# EAGLE design ChameleonMini-RevG (EAGLE 6.6.0)

## Sheet 1 of 2
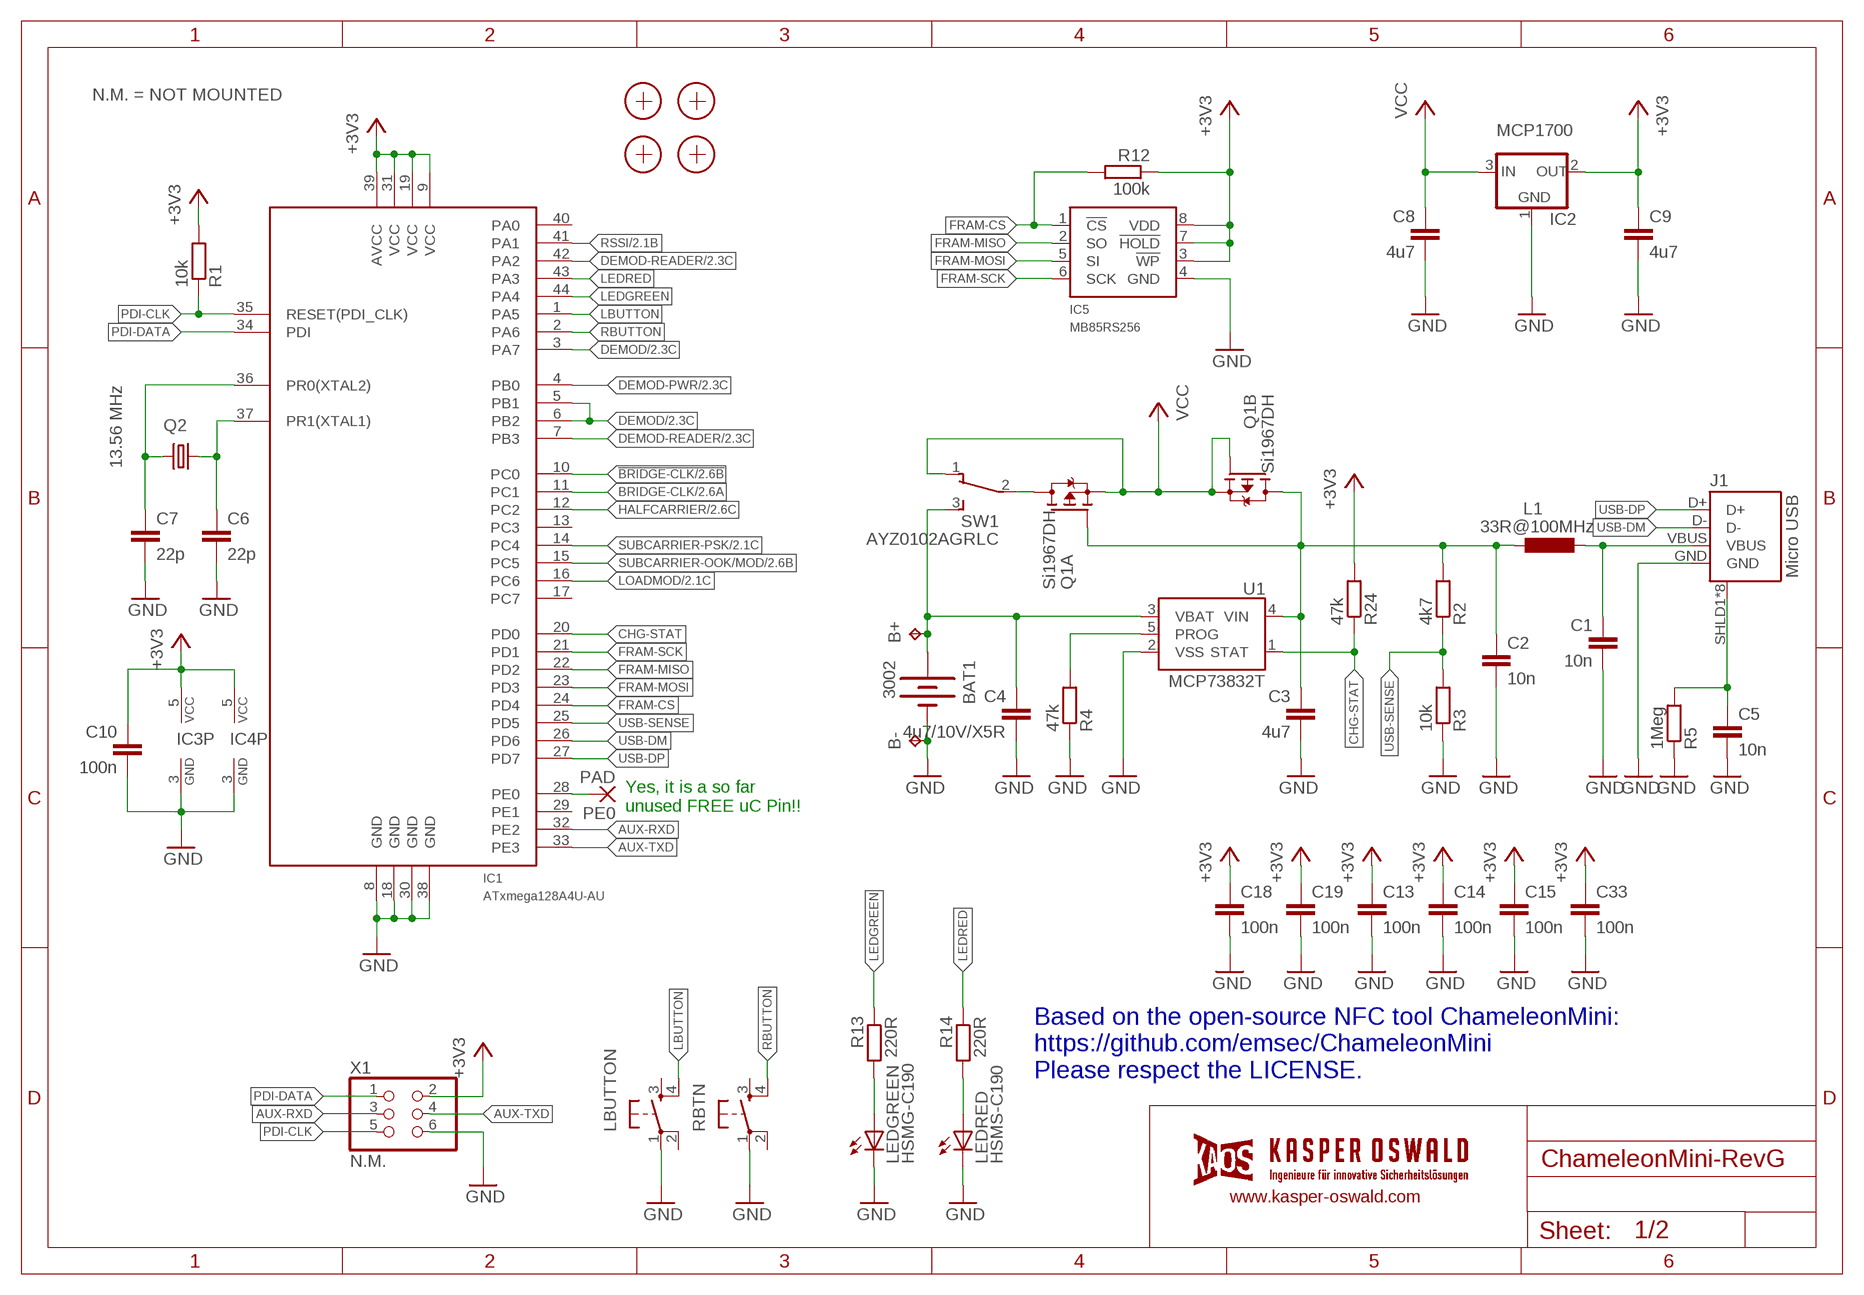
[diagram p0: schematic, sheet 1]

### Parts
B+  TPTP18SQ  [TP18SQ]
B-  TPTP18SQ  [TP18SQ]
BAT1  3002  [BATTCON_20MM]
C1  10n  C-EUC1206K  [C1206K]
C2  10n  C-EUC1206K  [C1206K]
C3  4u7  C-EUC0603K  [C0603K]
C4  4u7/10V/X5R  C-EUC0603K  [C0603K]
C5  10n  C-EUC0603K  [C0603K]
C6  22p  C-EUC0603K  [C0603K]
C7  22p  C-EUC0603K  [C0603K]
C8  4u7  C-EUC0603K  [C0603K]
C9  4u7  C-EUC0603K  [C0603K]
C10  100n  C-EUC0603K  [C0603K]
C13  100n  C-EUC0603K  [C0603K]
C14  100n  C-EUC0603K  [C0603K]
C15  100n  C-EUC0603K  [C0603K]
C18  100n  C-EUC0603K  [C0603K]
C19  100n  C-EUC0603K  [C0603K]
C33  100n  C-EUC0603K  [C0603K]
IC1  ATxmega128A4U-AU  ATXMEGA_A4-A  [TQFP44]
IC2  MCP1700  MCP1702  [SOT23]
IC3  7408  74LVC1G08DCK  [SC70-5]
IC4  7486  74AHC1G86DCK  [SC70-5]
IC5  MB85RS256  MB85RS  [SO-08]
J1  Micro USB  USB-MICROB-2  [USB-MICROB-10118194]
L1  33R@100MHz  L-EUL2012C  [L2012C]
LBUTTON  SWITCH_SPST_4_PINSQUARE  [TACTILE-SWITCH-SMD]
LEDGREEN  HSMG-C190  LED-0603  [CHIPLED-0603]
LEDRED  HSMS-C190  LED-0603  [CHIPLED-0603]
PE0  PAD  WIREPADSMD1,27-254  [SMD1,27-2,54]
Q1  Si1967DH  BSS84AKS  [SOT363]
Q2  13.56 MHz  TXC7B  [5MMX3.2MM]
R1  10k  R-EU_R0603  [R0603]
R2  4k7  R-EU_R0603  [R0603]
R3  10k  R-EU_R0603  [R0603]
R4  47k  R-EU_R0603  [R0603]
R5  1Meg  R-EU_R0603  [R0603]
R12  100k  R-EU_R0603  [R0603]
R13  220R  R-EU_R0603  [R0603]
R14  220R  R-EU_R0603  [R0603]
R24  47k  R-EU_R0603  [R0603]
RBTN  SWITCH_SPST_4_PINSQUARE  [TACTILE-SWITCH-SMD]
SW1  AYZ0102AGRLC  [AYZ0102AGRLC]
U1  MCP73832T  MCP73831  [SOT23-5]
X1  N.M.  PINHD-2X3-2.54-EDGE  [PINHD-2X3-2.54-EDGE]
X2  PASSER-07  [PASSER_07MM]
X4  PASSER-07  [PASSER_07MM]
X5  PASSER-07  [PASSER_07MM]
X6  PASSER-07  [PASSER_07MM]

### Nets
!BRIDGE-CLK: IC1.10(PC0) ; also sheet 2
+3V3: C9.1 C10.1 C13.1 C14.1 C15.1 C18.1 C19.1 C33.1 IC1.9(VCC) IC1.19(VCC) IC1.31(VCC) IC1.39(AVCC) IC2.2(OUT) IC3.5(VCC) IC4.5(VCC) IC5.3(!WP) IC5.7(!HOLD) IC5.8(VDD) R1.2 R12.1 R24.2 X1.2 ; also sheet 2
AUX-RXD: IC1.32(PE2) X1.3
AUX-TXD: IC1.33(PE3) X1.4
BRIDGE-CLK: IC1.11(PC1) ; also sheet 2
CHG-STAT: IC1.20(PD0) R24.1 U1.1(STAT)
DEMOD: IC1.3(PA7) IC1.5(PB1) IC1.6(PB2) ; also sheet 2
DEMOD-PWR: IC1.4(PB0) ; also sheet 2
DEMOD-READER: IC1.7(PB3) IC1.42(PA2) ; also sheet 2
FRAM-CS: IC1.24(PD4) IC5.1(!CS) R12.2
FRAM-MISO: IC1.22(PD2) IC5.2(SO)
FRAM-MOSI: IC1.23(PD3) IC5.5(SI)
FRAM-SCK: IC1.21(PD1) IC5.6(SCK)
GND: B-.TP BAT1.- C1.2 C2.2 C3.2 C4.2 C5.2 C6.2 C7.2 C8.2 C9.2 C10.2 C13.2 C14.2 C15.2 C18.2 C19.2 C33.2 IC1.8(GND) IC1.18(GND) IC1.30(GND) IC1.38(GND) IC2.1(GND) IC3.3(GND) IC4.3(GND) IC5.4(GND) J1.GND LBUTTON.1 LEDGREEN.C LEDRED.C R3.1 R4.1 R5.1 RBTN.1 U1.2(VSS) X1.6 ; also sheet 2
HALFCARRIER: IC1.12(PC2) ; also sheet 2
LBUTTON: IC1.1(PA5) LBUTTON.4
LEDGREEN: IC1.44(PA4) R13.1
LEDRED: IC1.43(PA3) R14.1
LOADMOD: IC1.16(PC6) ; also sheet 2
N$5: C7.1 IC1.36(PR0(XTAL2)) Q2.3
N$7: C1.1 J1.VBUS L1.1
N$8: C6.1 IC1.37(PR1(XTAL1)) Q2.1
N$9: LEDGREEN.A R13.2
N$13: LEDRED.A R14.2
N$18: Q1.6(A:D) SW1.2(P)
N$21: C2.1 C3.1 L1.2 Q1.2(A:G) Q1.3(B:D) R2.2 U1.4(VIN)
N$24: IC1.28(PE0) PE0.1(P)
N$28: R4.2 U1.5(PROG)
N$31: B+.TP BAT1.+2(+) C4.1 SW1.3(S) U1.3(VBAT)
N$59: C5.1 J1.SHLD1(SHIELD) J1.SHLD2(SHIELD) J1.SHLD3(SHIELD) J1.SHLD4(SHIELD) J1.SHLD5(SHIELD) J1.SHLD6(SHIELD) J1.SHLD7(SHIELD) J1.SHLD8(SHIELD) R5.2
PDI-CLK: IC1.35(RESET(PDI_CLK)) R1.1 X1.5
PDI-DATA: IC1.34(PDI) X1.1
RBUTTON: IC1.2(PA6) RBTN.4
RSSI: IC1.41(PA1) ; also sheet 2
SUBCARRIER-OOK/MOD: IC1.15(PC5) ; also sheet 2
SUBCARRIER-PSK: IC1.14(PC4) ; also sheet 2
USB-DM: IC1.26(PD6) J1.D-
USB-DP: IC1.27(PD7) J1.D+
USB-SENSE: IC1.25(PD5) R2.1 R3.2
VCC: C8.1 IC2.3(IN) Q1.1(A:S) Q1.4(B:S) Q1.5(B:G) SW1.1(O)
Unconnected: IC1.13(PC3) IC1.17(PC7) IC1.29(PE1) IC1.40(PA0) LBUTTON.2 LBUTTON.3 RBTN.2 RBTN.3

### Notes on the sheet
- N.M. = NOT MOUNTED
- Yes, it is a so far
  unused FREE uC Pin!!
- Based on the open-source NFC tool ChameleonMini:
  https://github.com/emsec/ChameleonMini
  Please respect the LICENSE.
- www.kasper-oswald.com

## Sheet 2 of 2
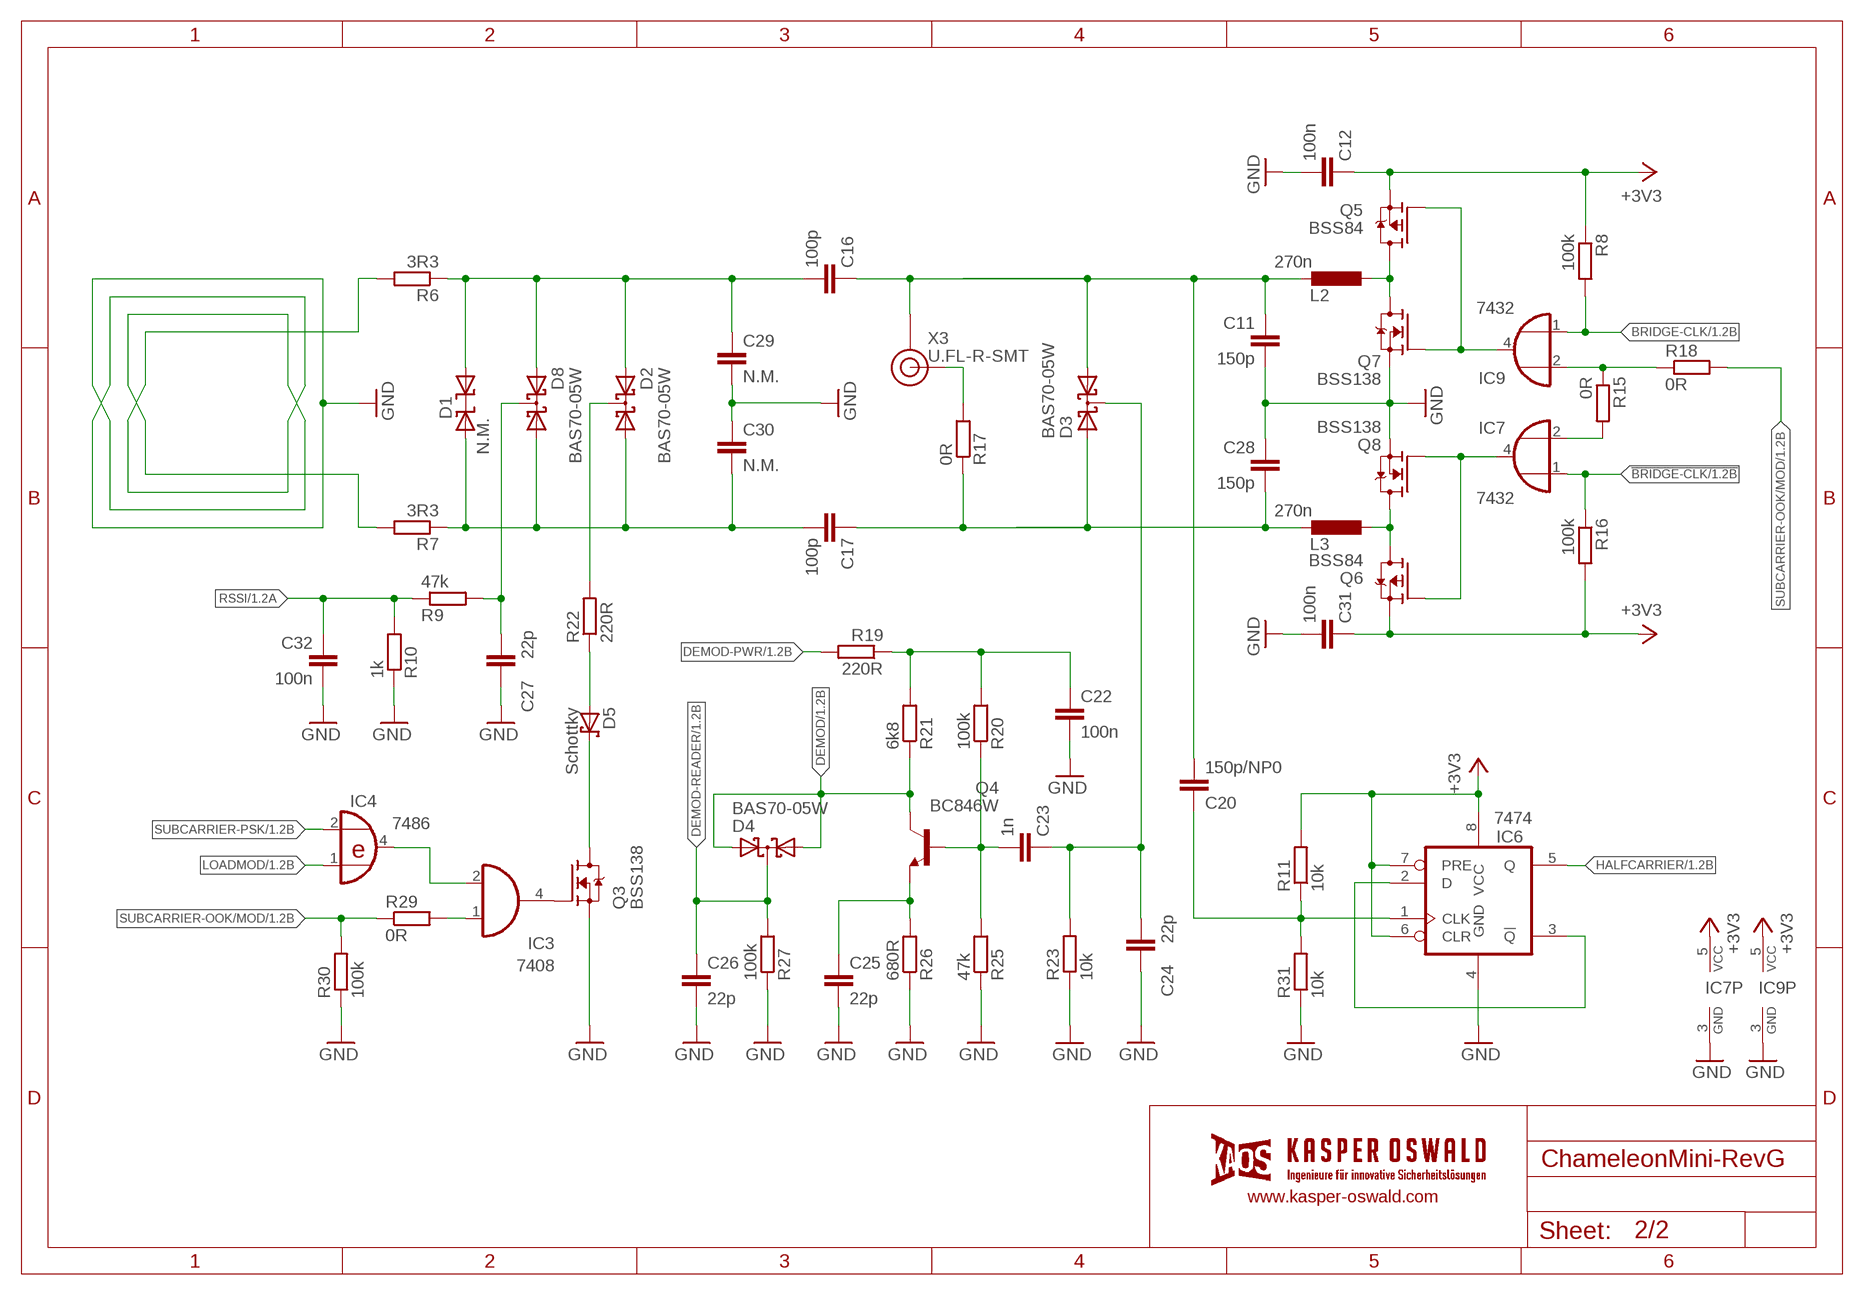
[diagram p1: schematic, sheet 2]

### Parts
C11  150p  C-EUC0603K  [C0603K]
C12  100n  C-EUC0603K  [C0603K]
C16  100p  C-EUC0603K  [C0603K]
C17  100p  C-EUC0603K  [C0603K]
C20  150p/NP0  C-EUC0603K  [C0603K]
C22  100n  C-EUC0603K  [C0603K]
C23  1n  C-EUC0603K  [C0603K]
C24  22p  C-EUC0603K  [C0603K]
C25  22p  C-EUC0603K  [C0603K]
C26  22p  C-EUC0603K  [C0603K]
C27  22p  C-EUC0603K  [C0603K]
C28  150p  C-EUC0603K  [C0603K]
C29  N.M.  C-EUC0603K  [C0603K]
C30  N.M.  C-EUC0603K  [C0603K]
C31  100n  C-EUC0603K  [C0603K]
C32  100n  C-EUC0603K  [C0603K]
D1  N.M.  SMAJ  [DO214AC]
D2  BAS70-05W  [SOT323]
D3  BAS70-05W  [SOT323]
D4  BAS70-05W  [SOT323]
D5  Schottky  1PS76SB70  [SOD323(F)]
D8  BAS70-05W  [SOT323]
IC6  7474  74LVC1G74DC  [VSSOP8]
IC7  7432  74AHC1G32DCK  [SC70-5]
IC9  7432  74AHC1G32DCK  [SC70-5]
L2  270n  L-EUL2012C  [L2012C]
L3  270n  L-EUL2012C  [L2012C]
Q3  BSS138  BSS138BKW  [SOT323]
Q4  BC846W  BC84XW  [SOT323]
Q5  BSS84  BSS84AKW  [SOT323]
Q6  BSS84  BSS84AKW  [SOT323]
Q7  BSS138  BSS138BKW  [SOT323]
Q8  BSS138  BSS138BKW  [SOT323]
R6  3R3  R-EU_R0603  [R0603]
R7  3R3  R-EU_R0603  [R0603]
R8  100k  R-EU_R0603  [R0603]
R9  47k  R-EU_R0603  [R0603]
R10  1k  R-EU_R0603  [R0603]
R11  10k  R-EU_R0603  [R0603]
R15  0R  R-EU_R0603  [R0603]
R16  100k  R-EU_R0603  [R0603]
R17  0R  R-EU_R0603  [R0603]
R18  0R  R-EU_R0603  [R0603]
R19  220R  R-EU_R0603  [R0603]
R20  100k  R-EU_R0603  [R0603]
R21  6k8  R-EU_R0603  [R0603]
R22  220R  R-EU_R0603  [R0603]
R23  10k  R-EU_R0603  [R0603]
R25  47k  R-EU_R0603  [R0603]
R26  680R  R-EU_R0603  [R0603]
R27  100k  R-EU_R0603  [R0603]
R29  0R  R-EU_R0603  [R0603]
R30  100k  R-EU_R0603  [R0603]
R31  10k  R-EU_R0603  [R0603]
X3  U.FL-R-SMT  [U.FL-R-SMT]

### Nets
!BRIDGE-CLK: IC7.1(I0) R16.1 ; also sheet 1
+3V3: C12.1 C31.1 IC6.6(CLR) IC6.7(PRE) IC6.8(VCC) IC7.5(VCC) IC9.5(VCC) Q5.2(S) Q6.2(S) R8.1 R11.2 R16.2 ; also sheet 1
ANTENNA-A: C11.1 C16.1 C20.2 D3.2(A2) L2.2 X3.GND1(GND)
ANTENNA-B: C17.1 C28.2 D3.1(A1) L3.2 R17.1
BRIDGE-1: IC9.4(O) Q5.1(G) Q7.1(G)
BRIDGE-2: IC7.4(O) Q6.1(G) Q8.1(G)
BRIDGE-CLK: IC9.1(I0) R8.2 ; also sheet 1
DEMOD: D4.1(A1) D4.2(A2) Q4.3(C) R21.1 ; also sheet 1
DEMOD-PWR: R19.2 ; also sheet 1
DEMOD-READER: C26.1 D4.3(K) R27.2 ; also sheet 1
GND: C11.2 C12.2 C22.2 C24.2 C25.2 C26.2 C27.2 C28.1 C29.2 C30.1 C31.2 C32.2 IC6.4(GND) IC7.3(GND) IC9.3(GND) Q3.2(S) Q7.2(S) Q8.2(S) R6.2 R7.2 R10.1 R23.1 R25.1 R26.1 R27.1 R30.1 R31.1 ; also sheet 1
HALFCARRIER: IC6.5(Q) ; also sheet 1
LOADMOD: IC4.1(I0) ; also sheet 1
MOD-DEMOD: D2.3(K) R22.2
MOD-DEMOD1: C23.1 C24.1 D3.3(K) R23.2
N$1: C25.1 Q4.2(E) R26.2
N$2: IC7.2(I1) R15.2
N$3: D5.1(K) Q3.3(D)
N$4: IC6.2(D) IC6.3(!Q)
N$6: C16.2 C29.1 D1.2 D2.1(A1) D8.1(A1) R6.1
N$10: L2.1 Q5.3(D) Q7.3(D)
N$11: IC3.2(I1) IC4.4(O)
N$12: D5.2(A) R22.1
N$14: IC3.4(O) Q3.1(G)
N$15: R17.2 X3.SIG
N$16: L3.1 Q6.3(D) Q8.3(D)
N$17: C17.2 C30.2 D1.1 D2.2(A2) D8.2(A2) R7.1
N$19: C27.1 D8.3(K) R9.2
N$20: IC9.2(I1) R15.1 R18.1
N$56: C23.2 Q4.1(B) R20.1 R25.2
N$1234: C20.1 IC6.1(CLK) R11.1 R31.2
N$11111: IC3.1(I0) R29.2
N$12345: C22.1 R19.1 R20.2 R21.2
RSSI: C32.1 R9.1 R10.2 ; also sheet 1
SUBCARRIER-OOK/MOD: R18.2 R29.1 R30.2 ; also sheet 1
SUBCARRIER-PSK: IC4.2(I1) ; also sheet 1
Unconnected: X3.GND2(GND)

### Notes on the sheet
- www.kasper-oswald.com

## Library data of the parts
B+ B- = testpad:TP: Test pad
BAT1 = Keystone-3002:3002
C1-C20 C22-C33 = rcl:C-EU: CAPACITOR, European symbol
D1 = Suppressor:SMAJ
D2-D4 D8 = NXP-Diode:BAS70-05
D5 = nxp_60:1PS76SB70: General-purpose Schottky diode General-purpose Schottky diodes in small Surface-Mounted Device (SMD) plastic packages. AAL Eindhoven MK
IC1 = _ATxmega:ATXMEGA_A4
IC2 = Microchip-MCP1702:MCP1702
IC3 = 74xx-little-de:74*1G08: 2-input AND gate
IC4 = 74xx-little-de:74*1G86: 2-input EXCLUSIV-OR gate
IC5 = Fujitsu-FRAM:MB85RS
IC6 = 74LVC1G74:74LVC1G74
IC7 IC9 = 74xx-little-de:74*1G32: 2-input OR gate
J1 = we-con:USB: USB Connectors; DIGIKEY: 609-4618-6-ND
L1-L3 = rcl:L-EU: INDUCTOR, European symbol
LBUTTON RBTN = SparkFun-Electromechanical:SWITCH_SPST_4_PIN; PROD_ID: SWCH-08247
LEDGREEN LEDRED = led:LED
PE0 = wirepad:WIREPAD: Wire PAD connect wire on PCB
Q1 = NXP-MOS:BSS84AKS
Q2 = TXC-Crystal:TXC7B
Q3 Q7 Q8 = NXP-MOS:BSS138BKW
Q4 = NXP-BJT:BC84X
Q5 Q6 = NXP-MOS:BSS84AKW
R1-R27 R29-R31 = rcl:R-EU_: RESISTOR, European symbol
SW1 = C&K-Switch:AYZ0102AGRLC
U1 = SparkFun:MCP73831: Microchip's MCP73831 Miniature single cell, fully integrated Li-Ion, Li-polymer charge management controller http://ww1.microchip.com/downloads/en/DeviceDoc/21984a.pdf
X1 = PINHD:PINHD-2X3
X2 X4-X6 = we-symbol:PASSER: Fiducial Markers
X3 = Hirose-UFL:U.FL-R-SMT

## Board
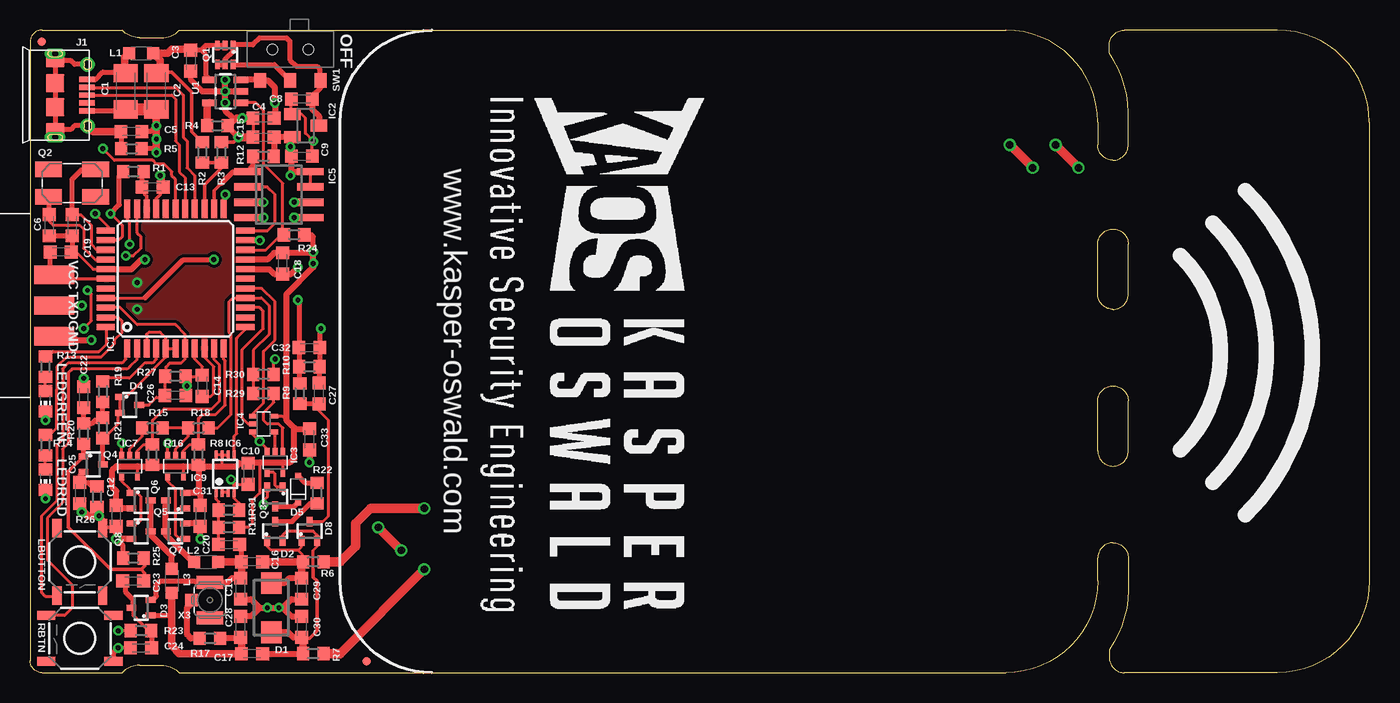
[diagram p2: board, top side]
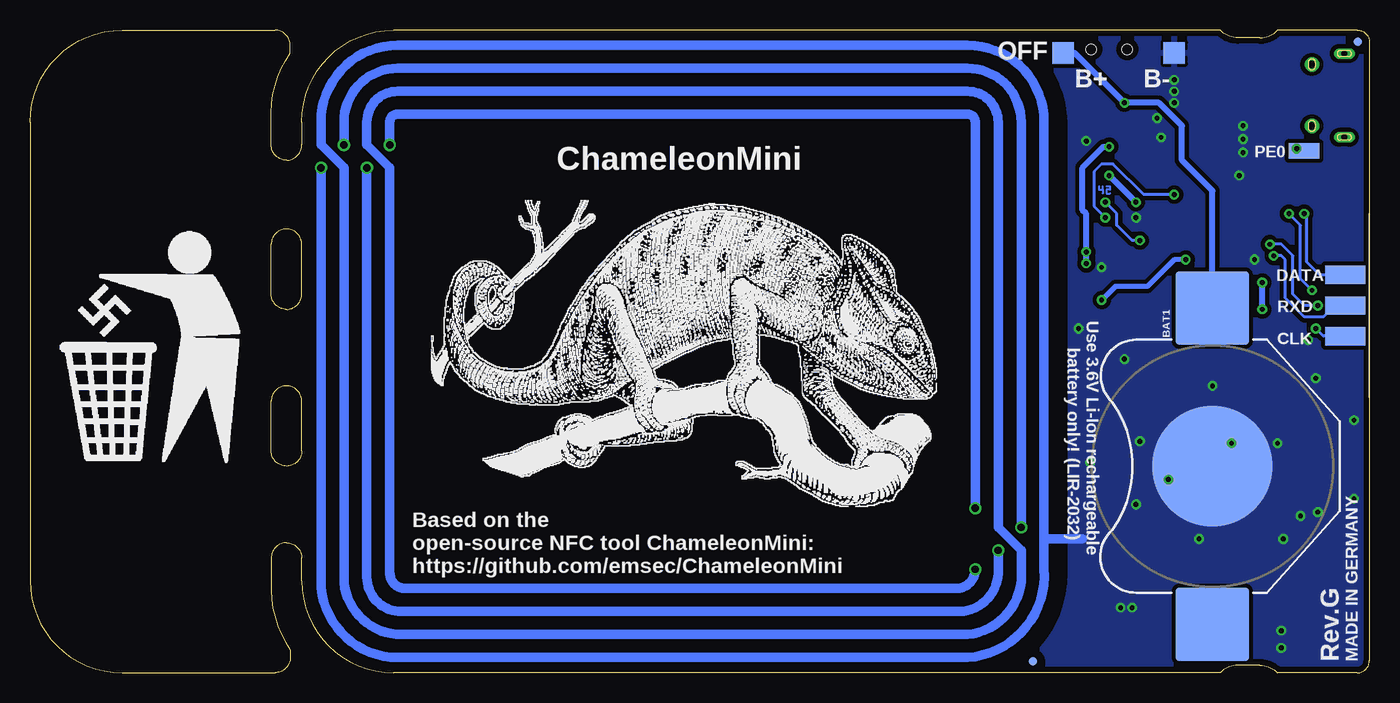
[diagram p3: board, bottom side, seen from below]

Size 111.12 x 53.34 mm. Coordinates in mm from the lower left corner, seen from the top.
Outline: 7.62,53.34 1,53.34 arc90 0,52.34 0,1 arc90 1,0 7.62,0 arc-45 9.08,0.63 10.92,0.63 arc-45 12.38,0 80.96,0 arc90 88.58,7.62 88.58,9.52 arc-90 89.85,10.79 arc-90 91.12,9.52 91.12,7.62 arc-38 89.53,1.9 89.53,1.27 arc90 90.81,0 103.5,0 arc90 111.12,7.62 111.12,45.72 arc90 103.5,53.34 90.81,53.34 arc90 89.53,52.07 89.53,51.44 arc-38 91.12,45.72 91.12,43.81 arc-90 89.85,42.55 arc-90 88.58,43.81 88.58,45.72 arc90 80.96,53.34 12.38,53.34
Outline: 9.08,52.7 arc-45 7.62,53.34
Outline: 10.92,52.7 arc45 12.38,53.34
Outline: 9.08,52.7 arc-45 7.62,53.34
Outline: 10.92,52.7 arc45 12.38,53.34
Outline: 9.08,52.7 10.92,52.7
Outline: 91.12,18.42 91.12,22.54 arc90 89.85,23.81 arc90 88.58,22.54 88.58,18.42 arc90 89.85,17.14 arc90 91.12,18.42
Outline: 91.12,31.43 91.12,35.56 arc90 89.85,36.83 arc90 88.58,35.56 88.58,31.43 arc90 89.85,30.16 arc90 91.12,31.43
Copper layers (1*16): Top 0.035mm / dielectric 1.5mm / Bottom 0.035mm
Design rules "default": minimum track width 0.15mm, minimum drill 0.3mm, track to track 0.15mm, track to pad 0.15mm, pad to pad 0.15mm, via to via 0.15mm, smd to smd 0.1mm, copper to edge 0.5mm, drill to drill 0.2mm, minimum pad ring 0.18mm, minimum via ring 0.2mm, stop-mask expansion 0.1mm, vias tented up to drill 0.5mm, thermal gap 0.25mm
Milling: 48 lines

### Footprints (pad centres in the part's own frame; a part is rotated, then mirrored left to right if it is on the bottom)
TP18SQ = smd 1.8 x 1.8: TP 0,0
BATTCON_20MM = smd 6.07 x 6.07: +1 -13.135,0; +2 13.135,0 | smd 10 x 10: - 0,0
C1206K = smd 1.5 x 2: 1 -1.5,0; 2 1.5,0
C0603K = smd 1.05 x 1.08: 1 -0.875,0; 2 0.875,0
DO214AC = smd 1.8 x 1.7: 1 2.05,0; 2 -2.05,0
SOT323 = smd 0.5 x 0.8: 1 -0.65,-0.8; 2 0.65,-0.8; 3 0,0.8
SOD323(F) = smd 0.5 x 0.5: 1 1.1,0; 2 -1.1,0
TQFP44 = smd 1.5 x 0.5: 1 -5.8,4; 2 -5.8,3.2; 3 -5.8,2.4; 4 -5.8,1.6; 5 -5.8,0.8; 6 -5.8,0; 7 -5.8,-0.8; 8 -5.8,-1.6; 9 -5.8,-2.4; 10 -5.8,-3.2; 11 -5.8,-4; 23 5.8,-4; 24 5.8,-3.2; 25 5.8,-2.4; 26 5.8,-1.6; 27 5.8,-0.8; 28 5.8,0; 29 5.8,0.8; 30 5.8,1.6; 31 5.8,2.4; 32 5.8,3.2; 33 5.8,4 | smd 0.5 x 1.5: 12 -4,-5.8; 13 -3.2,-5.8; 14 -2.4,-5.8; 15 -1.6,-5.8; 16 -0.8,-5.8; 17 0,-5.8; 18 0.8,-5.8; 19 1.6,-5.8; 20 2.4,-5.8; 21 3.2,-5.8; 22 4,-5.8; 34 4,5.8; 35 3.2,5.8; 36 2.4,5.8; 37 1.6,5.8; 38 0.8,5.8; 39 0,5.8; 40 -0.8,5.8; 41 -1.6,5.8; 42 -2.4,5.8; 43 -3.2,5.8; 44 -4,5.8
SOT23 = smd 1 x 1.4: 1 -0.95,-1.1; 2 0.95,-1.1; 3 0,1.1
SC70-5 = smd 0.4 x 0.7: 1 -0.65,-0.85; 2 0,-0.85; 3 0.65,-0.85; 4 0.65,0.85; 5 -0.65,0.85
SO-08 = smd 0.6 x 2.2: 1 -1.905,-2.6; 2 -0.635,-2.6; 3 0.635,-2.6; 4 1.905,-2.6; 5 1.905,2.6; 6 0.635,2.6; 7 -0.635,2.6; 8 -1.905,2.6
VSSOP8 = smd 0.75 x 0.25: 1 -1.55,0.75; 2 -1.55,0.25; 3 -1.55,-0.25; 4 -1.55,-0.75; 5 1.55,-0.75; 6 1.55,-0.25; 7 1.55,0.25; 8 1.55,0.75
USB-MICROB-10118194 = smd 1.3 x 0.4: D+ -2.5,0; D- -2.5,-0.65; GND -2.5,1.3; ID -2.5,0.65; VBUS -2.5,-1.3 | drill 0.6 pad 1.2: SHLD1 -2.55,2.55; SHLD2 -2.55,-2.55 | drill 0.5 pad 0.8 long: SHLD3 0.15,3.5; SHLD4 0.15,-3.45 | smd 1.5 x 1.1: SHLD5 0.15,2.85; SHLD6 0.15,-2.85 | smd 1.5 x 1.5: SHLD7 0.15,1; SHLD8 0.15,-1
L2012C = smd 1 x 1: 1 -1,0; 2 1,0
TACTILE-SWITCH-SMD = smd 1.524 x 0.762: 1 -2.794,1.905; 2 2.794,1.905; 3 -2.794,-1.905; 4 2.794,-1.905
CHIPLED-0603 = smd 1.1 x 1: A 0,-0.85; C 0,0.85
SMD1,27-2,54 = smd 1.27 x 2.54: 1 0,0
SOT363 = smd 0.4 x 0.8: 1 -0.65,-0.8; 2 0,-0.8; 3 0.65,-0.8; 4 0.65,0.8; 5 0,0.8; 6 -0.65,0.8
5MMX3.2MM = smd 2.2 x 1.3: 1 -1.95,-1.15; 2 1.95,-1.15; 3 1.95,1.15; 4 -1.95,1.15
R0603 = smd 1 x 1.1: 1 -0.85,0; 2 0.85,0
AYZ0102AGRLC = smd 1 x 1.2: 1 -2.5,2.6; 2 0,2.6; 3 2.5,2.6 | hole 0.85: -1.5,0; 1.5,0
SOT23-5 = smd 0.55 x 1.2: 1 -0.95,-1.3; 2 0,-1.3; 3 0.95,-1.3; 4 0.95,1.3; 5 -0.95,1.3
PINHD-2X3-2.54-EDGE = smd 3.302 x 1.524 bottom: 1 2,2.54; 3 2,0; 5 2,-2.54 | smd 3.302 x 1.524: 2 2,2.54; 4 2,0; 6 2,-2.54
PASSER_07MM = smd 0.7 x 0.7: X 0,0
U.FL-R-SMT = smd 1.05 x 2.2: GND1 -1.475,0; GND2 1.475,0 | smd 1 x 1.05: SIG 0,-1.525

### Placement (x,y rotation side)
B+  25.4,51.44 0 bottom
B-  16.19,51.44 0 bottom
BAT1  13.02,17.14 90 bottom
C1  7.94,48.26 270 top
C2  10.48,48.26 270 top
C3  13.33,50.8 270 top
C4  19.37,46.04 180 top
C5  8.41,44.93 0 top
C6  1.59,37.15 270 top
C7  3.49,37.15 270 top
C8  22.54,47.62 180 top
C9  22.54,42.86 0 top
C10  18.1,16.51 270 top
C11  17.46,6.98 270 top
C12  7.14,13.02 270 top
C13  10.16,40.32 0 top
C14  14.29,23.81 90 top
C15  19.37,44.45 180 top
C16  18.42,9.21 0 top
C17  18.42,1.59 0 top
C18  20.96,33.97 270 top
C19  2.54,34.92 0 top
C20  16.51,10.64 0 top
C22  4.45,22.86 90 top
C23  8.55,7.62 0 top
C24  9.21,2.06 180 top
C25  4.13,14.92 270 top
C26  12.07,23.02 0 top
C27  23.97,23.18 90 top
C28  17.46,3.81 270 top
C29  22.54,6.98 270 top
C30  22.54,3.81 270 top
C31  14.13,13.02 270 top
C32  23.18,26.99 0 top
C33  23.18,19.37 270 top
D1  20,5.4 270 top
D2  20.32,11.75 0 top
D3  9.21,5.4 90 top
D4  8.25,22.22 270 top
D5  22.22,15.24 270 top
D8  23.18,11.75 0 top
IC1  12.07,32.7 90 top
IC2  22.86,45.4 270 top
IC3  20.32,17.46 180 top
IC4  19.37,20.64 270 top
IC5  20.64,39.69 270 top
IC6  16.19,16.51 90 top
IC7  8.25,17.14 180 top
IC9  12.07,17.14 180 top
J1  2.22,47.94 180 top
L1  9.21,51.44 0 top
L2  14.61,9.21 0 top
L3  11.75,7.62 270 top
LBUTTON  4.13,9.21 270 top
LEDGREEN  1.27,22.54 180 top
LEDRED  1.27,16.03 180 top
PE0  5.43,43.31 270 bottom
Q1  16.19,51.28 180 top
Q2  3.49,40.64 0 top
Q3  20.32,14.6 180 top
Q4  5.24,17.3 270 top
Q5  12.07,14.29 90 top
Q6  9.21,14.29 270 top
Q7  12.07,11.75 90 top
Q8  9.21,11.75 270 top
R1  8.57,41.59 0 top
R2  14.29,43.18 90 top
R3  15.87,43.18 270 top
R4  15.56,45.4 180 top
R5  8.41,43.5 180 top
R6  23.5,9.21 0 top
R7  23.5,1.59 0 top
R8  13.97,18.1 90 top
R9  22.38,23.18 270 top
R10  23.18,25.4 180 top
R11  16.51,12.07 0 top
R12  19.37,42.86 180 top
R13  1.27,25.4 270 top
R14  1.27,18.89 270 top
R15  10.16,20.32 180 top
R16  10.16,18.1 270 top
R17  14.92,2.86 180 top
R18  13.97,20.32 0 top
R19  6.03,23.34 90 top
R20  4.45,19.84 90 top
R21  6.03,20.32 90 top
R22  23.81,14.92 270 top
R23  9.21,3.49 0 top
R24  21.91,36.35 0 top
R25  8.57,9.52 0 top
R26  5.56,14.61 90 top
R27  12.07,24.61 180 top
R29  19.37,23.18 0 top
R30  19.37,24.76 180 top
R31  16.51,13.49 180 top
RBTN  4.13,2.86 180 top
SW1  21.59,51.75 180 top
U1  16.19,48.26 90 top
X1  0,30.48 0 top
X2  0.95,52.39 0 top
X3  14.92,6.03 270 top
X4  27.94,0.95 0 top
X5  27.94,0.95 0 bottom
X6  0.95,52.39 0 bottom

### Tracks (layer width: path | path; a pad name or v marks a point on that pad's centre or on a via)
!BRIDGE-CLK
  Top 0.25: IC1.10 15.26,26.01 15.72,25.56 15.72,22.54 15.08,21.91 11.11,21.91 10.16,20.96 R16.1 9.42,18.95 8.9,18.43 IC7.1
+3V3  (via drill 0.4)
  Top 0.25: IC6.7 IC6.6 | IC6.7 IC6.8 | 20.32,44.45 C15.1 | 20.24,42.89 R12.1 | IC5.8 IC5.7 | v19.37,39.05 IC5.3 | IC1.9 14.46,26.18 15.24,25.4 15.24,23.18 15,22.94 C14.1 | IC1.39 2.32,32.7 X1.2 1.66,33.36 | IC7.5 8.9,17.13 8.89,17.14 | R11.2 18.1,12.06 18.42,12.38 18.42,14.29 19.05,14.92 19.05,17.46 | IC9.5 12.71,17.13 12.7,17.14 | IC3.5 20.97,17.45 20.96,17.46 | IC6.7 15.94,17.21 15.87,17.14 | IC4.5 20.94,21.29 21.27,20.96 | v23.5,34.92 v23.5,34.93 v23.5,34.92 | 23.5,33.66 v23.5,33.97 | v23.5,33.97 | v23.5,34.92
  Top 0.305: IC1.31 9.67,39.55 9.53,39.69 9.53,40.08 C13.1 | 9.29,41.45 R1.2
  Top 0.406: 1.66,33.36 C19.1 | R24.2 23.34,36.35 23.5,36.19 v23.5,34.93 | C13.1 9.29,41.45
  Top 0.5: 20.32,44.45 IC2.2 21.59,44.28 v21.59,43.66 21.67,43.58 C9.1 21.67,41.35 v21.59,41.28 21.91,41.59 IC5.8 | C15.1 20.24,42.89 | IC1.19 19.7,34.3 20.24,34.85 C18.1 23.42,34.85 v23.5,34.92 23.5,33.66 21.27,31.43 21.27,20.96 21.91,20.32 | 21.91,20.32 21.91,17.78 21.59,17.46 20.96,17.46 19.05,17.46 18.1,17.46 C10.1 17.39,17.39 17.14,17.14 15.87,17.14 14.07,17.14 R8.1 | Q5.2 13.96,14.94 13.97,14.92 | 12.7,17.14 10.26,17.14 R16.2 10.06,17.14 8.89,17.14 7.14,17.14 6.83,16.83 6.83,15.4 7.14,15.08 C12.1 7.4,13.64 Q6.2 | C33.1 21.99,20.24 21.91,20.32 | C31.1 14.13,14.76 13.97,14.92 | 12.71,17.13 13.85,17.13 R8.1 | R8.1 13.97,14.92
  Bottom 0.5: v21.59,41.28 v19.37,39.05 | v21.59,43.66 22.07,43.66 23.81,41.91 23.81,38.42 23.5,38.1 v23.5,33.97 | v8.89,30.16 v8.89,32.39 | v23.5,33.97
  pour Top (isolate 0.25): 15.87,38.42 8.25,38.42 6.35,36.51 6.35,28.26 7.62,26.99 15.87,26.99 17.78,28.89 17.78,36.51
ANTENNA-A
  Top 0.25: 17.07,10.32 C20.2
  Top 0.305: 10.02,6.03 D3.2
  Top 0.406: 14.97,7.55 X3.GND1 13.76,7.51 13.65,7.62 10.79,7.62 10.48,7.3 10.48,6.35 10.18,6.05 D3.2 | C16.1 17.54,10.48 C20.2 | 17.54,7.94 C11.1
  Top 0.5: X3.GND1 16.4,7.51 16.75,7.86 C11.1 17.51,7.91
  Top 0.61: L2.2 C16.1 17.54,7.94
ANTENNA-B
  Top 0.305: L3.2 11.38,6.62 | 10.02,4.76 D3.1
  Top 0.406: 10.02,4.76 11.75,4.76
  Top 0.5: R17.1 17.39,2.86 C28.2
  Top 0.61: C28.2 17.54,2.86 C17.1 12.38,1.59 11.75,2.22 11.75,4.76 L3.2
AUX-RXD  (via drill 0.4)
  Top 0.25: v7.94,34.61 8.57,34.61 9.21,35.24 9.21,36.19 8.89,36.51 8.86,36.54 IC1.32
  Bottom 0.25: v7.94,34.61 7.3,34.61 6.99,34.29 6.99,31.11 5.4,29.53 3.81,29.53 2.86,30.48 X1.3
AUX-TXD  (via drill 0.4)
  Top 0.25: IC1.33 8.07,37.66 8.25,37.47 v8.25,35.56 | X1.4 v4.29,30.48
  Bottom 0.25: v8.25,35.56 7.3,35.56 6.35,34.61 6.35,31.43 5.4,30.48 v4.29,30.48
BRIDGE-1
  Top 0.25: 12.07,13.33 12.37,13.64 Q5.1 | 12.07,13.33 12.07,11.43 12.4,11.1 Q7.1 | 12.07,13.33 12.07,15.24 11.42,15.89 IC9.4
BRIDGE-2
  Top 0.25: Q8.1 8.9,12.4 9.21,12.7 9.21,14.61 8.87,14.94 Q6.1 8.25,15.09 8.25,15.24 7.61,15.89 IC7.4
BRIDGE-CLK
  Top 0.25: IC1.11 16.07,26 16.19,25.88 16.19,22.22 15.39,21.42 14.28,21.42 13.97,21.11 R8.2 13.23,18.95 12.71,18.43 IC9.1
CHG-STAT
  Top 0.25: 19.37,46.67 19.37,42.23 20.96,40.64 20.96,36.51 | IC1.20 19.54,35.1 20.96,36.51 | R24.1 21.06,36.41 20.96,36.51
  Top 0.254: 19.37,46.67 18.73,47.31 U1.1
DEMOD
  Top 0.25: D4.2 D4.1 | IC1.5 11.26,26.19 8.25,23.18 | IC1.5 IC1.6 | IC1.3 9.67,28.08 9.84,28.26 10.79,28.26 11.26,27.79 IC1.5
  Top 0.254: 8.25,23.18 7.94,22.86 7.47,22.86 D4.1 | R21.1 6.14,19.47 7.3,20.64 7.3,21.42 D4.2
  Top 0.406: Q4.3 R21.1
DEMOD-PWR
  Top 0.25: 10.46,26.02 IC1.4
  Top 0.254: 10.46,26.02 10.16,25.72 9.53,25.72 8.25,24.45 6.29,24.45 R19.2
DEMOD-READER
  Top 0.25: IC1.42 7.48,30.3 8.89,28.89 12.07,28.89 12.86,28.09 IC1.7 12.86,26.04 12.53,25.7 11.58,25.7 11.27,25.4 11.27,24.61 R27.2 11.21,23.04 C26.1
  Top 0.254: D4.3 9.84,22.22 10.48,22.86 11.03,22.86 C26.1
FRAM-CS
  Top 0.305: IC1.24 15.26,40.03 15.87,40.64 | 17.14,41.59 IC5.1
  Top 0.406: R12.2 18.52,42.07 IC5.1 | 15.87,40.64 16.83,41.59 17.14,41.59
FRAM-MISO
  Top 0.25: IC5.2 19.68,40.32 20.32,39.69 20.32,37.31 19.72,36.7 IC1.22
FRAM-MOSI  (via drill 0.4)
  Top 0.25: IC1.23 16.07,39.56 v16.19,39.69 | v21.91,37.78 IC5.5
  Bottom 0.25: v16.19,39.69 18.73,39.69 21.27,42.23 22.22,42.23 22.86,41.59 22.86,38.73 v21.91,37.78
FRAM-SCK  (via drill 0.4)
  Top 0.25: v21.91,39.05 IC5.6 | IC1.21 19.03,35.9 v19.05,35.88
  Bottom 0.25: v21.91,39.05 20.96,38.1 20.96,37.15 19.68,35.88 v19.05,35.88
GND  (via drill 0.4, 0.6)
  Top 0.25: v1.27,14.45 LEDRED.C | LEDGREEN.C v1.27,20.96 | U1.2 v16.19,48.26 | C8.2 21.67,46.45 IC2.1 22.54,46.35 22.86,46.04 22.86,44.77 v23.5,44.13 23.42,44.05 C9.2 | IC5.4 v19.37,37.78 | C4.2 C15.2 | IC1.8 13.67,26.02 14.29,25.4 C14.2 14.21,24.61 R27.1 12.94,24.58 13.02,24.58 v13.02,23.81 13.02,23.02 C26.2 | IC1.38 5.23,33.5 3.81,34.92 C19.2 3.49,35 | 16.94,15.76 IC6.4 16.94,14.49 17.36,14.07 R31.1 | 16.94,15.76 v16.67,16.03 | R23.1 v7.3,3.49 | C24.2 v7.3,2.06 | C10.2 17.07,15.64 16.94,15.76 | Q3.2 19.67,14.59 19.37,14.29 v19.37,13.97 | R10.1 24.05,25.43 | C27.2 24.03,24.11 | 24.05,28.5 v24.13,28.57 | R30.1 20.22,25.93 v20.32,26.04 | IC7.3 7.61,19.04 v7.62,19.05 | IC9.3 11.42,19.04 v11.43,19.05 | IC4.3 18.52,19.74 v19.05,19.21 19.67,18.59 IC3.3
  Top 0.305: IC1.30 10.46,39.36 10.79,39.69 10.79,40.08 C13.2 11.04,41.03 v10.79,41.28 | v4.29,13.33 4.29,13.89 C25.2 | 6.03,12.06 6.99,12.06 | R3.1 16.89,44.03 v17.29,44.43
  Top 0.406: C6.2 C7.2 3.49,35 | 24.05,25.43 C32.2 24.05,28.5 | 24.03,24.11 R10.1 | 9.13,46.68 9.21,46.76 | 13.33,49.53 C3.2 13.33,49.21 14.29,48.26 | C5.2 10,44.93 v10.48,45.4 C2.2 | R5.1 10.16,43.5 v10.48,43.18 | J1.GND 7.82,46.64 C1.2 | 16.41,45.31 v17.29,44.43 | 16.51,45.4 17.14,46.04 16.83,46.04 | v4.45,24.45 C22.2 | R25.1 7.72,10.53 v7.14,11.11 | LBUTTON.1 6.03,12.06 6.03,12.7 v5.71,13.02 5.71,13.6 R26.1 | RBTN.1 6.92,1.68 v7.3,2.06
  Top 0.5: 14.29,48.26 U1.2 | v16.19,47.31 v16.19,49.21 | 16.19,46.99 v16.19,47.31 | IC1.18 19.84,33.5 20.24,33.1 C18.2 21.67,33.1 v22.22,33.66 | IC1.38 8.42,33.5 9.21,34.29 v9.53,34.29 | X1.6 3.49,27.94 3.81,27.62 v5.08,27.62 | v14.13,11.11 C31.2 13.87,12.4 Q7.2 | C12.2 v7.14,11.11 7.16,11.1 Q8.2 | C11.2 18.34,6.11 19.05,5.4 | C28.1 18.34,4.68 19.05,5.4 | C30.1 21.67,4.68 20.96,5.4 | C29.2 21.67,6.11 20.96,5.4 | 19.05,5.4 v20.64,5.4 20.96,5.4 | C33.2 v23.18,17.46 | v23.18,17.46 | 16.83,46.04 16.19,46.67 v16.19,47.31
  Top 0.61: C4.2 v17.62,46.04 17.14,46.04 | v17.29,44.43 18.39,44.43 18.42,44.45 17.14,44.45 | R4.1 16.41,45.31 | v10.48,43.18 10.48,46.67 | 4.45,13.33 4.76,13.02 v5.71,13.02
  Top 0.8: v87,41.91 v85.09,43.81 | v83.19,41.91 v81.28,43.81 | v28.89,12.06 v30.8,10.16 | 32.62,13.57 v32.7,13.65 28.26,13.65 26.99,12.38 26.99,10.48 25.72,9.21 R6.2 | v32.7,8.57 25.72,1.59 R7.2
  Top 1: C1.2 9.21,46.76 C2.2
  Bottom 0.8: v32.7,8.57 arc90 34.29,6.98 80.01,6.98 arc90 81.28,8.25 81.28,41.91 83.19,43.81 83.19,45.72 arc90 80.65,48.26 33.34,48.26 arc90 30.8,45.72 30.8,12.06 28.89,10.16 28.89,8.57 arc90 33.34,3.18 80.33,3.18 arc90 85.09,7.94 85.09,41.91 87,43.81 87,45.72 arc90 80.65,52.07 33.34,52.07 arc90 26.99,45.72 26.99,11.11 | v85.09,43.81 85.09,45.72 arc90 80.65,50.17 33.34,50.17 arc90 28.89,45.72 v28.89,12.06 | v87,41.91 87,7.62 arc-90 80.65,1.27 33.34,1.27 arc-90 26.99,8.57 26.99,11.11 | v81.28,43.81 81.28,45.72 arc90 80.65,46.36 33.34,46.36 arc90 32.7,45.72 v32.7,13.65 | v83.19,41.91 83.19,7.94 arc-90 80.33,5.08 33.97,5.08 arc-90 30.8,8.57 v30.8,10.16 | 26.99,11.11 23.81,11.11
  other vias: 10.48,44.29 19.68,5.4
  pour Bottom (isolate 0.35): 34.29,54.61 0,54.61 0,-1.27 34.29,-1.27 arc-90 24.76,8.25 24.76,45.72 arc-90
HALFCARRIER
  Top 0.25: IC1.12 17.78,28.62 17.78,28.42 17.14,27.78 17.14,19.84 16.94,19.64 IC6.5
LBUTTON
  Top 0.25: 2.21,18.88 2.62,19.29
  Top 0.254: IC1.1 7.94,26.78 7.94,26.04 7.62,25.72 3.18,25.72 2.86,25.4 2.86,25.39 2.69,25.23 2.69,19.36 2.62,19.29 | 2.21,18.88 2.21,14.28 0.95,13.02 0.95,6.67 1.27,6.35 2.16,6.35 LBUTTON.4
LEDGREEN
  Top 0.25: R13.1 1.37,26.35
  Top 0.254: 1.37,26.35 1.59,26.35 1.91,26.67 5.71,26.67 6.35,27.3 6.35,28.62 IC1.44
LEDRED
  Top 0.25: IC1.43 7.33,29.5 7.62,29.21 7.62,28.26
  Top 0.254: 7.62,28.26 6.99,27.62 6.99,27.3 6.03,26.35 5.86,26.18 3,26.18 2.22,25.4 2.22,23.5 2.22,20.32 1.64,19.74
  Top 0.305: R14.1 1.64,19.74
LOADMOD
  Top 0.25: IC4.1 18.52,21.53 19.37,22.38 19.37,26.67 20.32,27.62 20.32,30.8 19.21,31.9 IC1.16
MOD-DEMOD
  Top 0.305: R22.2 23.28,14.07
  Top 0.406: D2.3 21.75,12.55 23.28,14.07
MOD-DEMOD1
  Top 0.254: 10.08,3.57 10.06,3.54 R23.2
  Top 0.305: 10.08,3.57 9.84,3.81 9.53,3.81 8.57,4.76 8.57,5.23 D3.3 8.57,5.4
  Top 0.406: 8.57,5.4 8.57,6.03 7.94,6.67 7.94,7.36 C23.1 | 10.08,3.47 C24.1
  Top 0.5: R23.2 10.08,3.47
N$1
  Top 0.406: R26.2 5.45,15.56 5.08,15.56 4.84,15.8 C25.1 4.13,16.34 Q4.2
N$2
  Top 0.25: IC7.2 8.25,18.57 9.31,19.63 R15.2
N$3
  Top 0.406: Q3.3 21.89,13.8 D5.1
N$4
  Top 0.25: IC6.3 IC6.2
N$5
  Top 0.25: 4.32,41.79 Q2.3 | C7.1 4.2,38.02 5.08,37.15 5.08,35.56 5.54,35.1 IC1.36
  Top 0.406: 4.32,41.79 3.49,40.96 C7.1
N$6
  Top 0.25: 22.22,10.16 22.53,10.46 D8.1 | 22.22,10.16 20,10.16 19.67,10.49 D2.1 | R6.1 22.64,9.74 22.22,10.16
  Top 0.5: D1.2 21.1,7.45 21.51,7.86 C29.1 | R6.1 22.54,9.11
  Top 0.61: C29.1 22.54,9.11 R6.1 C16.2
N$7
  Top 0.406: C1.1 7.85,49.85 6.03,49.85 5.43,49.24 J1.VBUS
  Top 0.61: 7.85,49.85 7.85,51.08 L1.1
N$8
  Top 0.25: 1.59,39.44 Q2.1 | C6.1 1.59,37.47 1.91,37.15 4.13,37.15 4.29,36.99 4.45,36.83 4.45,35.24 5.39,34.3 IC1.37
  Top 0.406: C6.1 1.59,39.44
N$9
  Top 0.25: LEDGREEN.A R13.2
N$10
  Top 0.5: Q5.3 Q7.3 11.26,11.44 13.61,9.1 L2.1 13.65,9.21
N$11
  Top 0.25: IC3.2 20.32,19.89 IC4.4
N$12
  Top 0.406: D5.2 22.79,15.77 R22.1
N$13
  Top 0.25: LEDRED.A R14.2
N$14
  Top 0.25: Q3.1 20.47,15.4 20.32,15.56 20.32,16.51 20.22,16.61 IC3.4
N$15
  Top 0.5: X3.SIG 13.65,6.03 13.02,5.4 13.02,3.18 13.33,2.86 R17.2
N$16
  Top 0.5: Q6.3 Q8.3 10.01,11.42 11.48,9.95 11.75,9.68 L3.1
N$17
  Top 0.25: D2.2 20.97,11.45 21.27,11.75 23.5,11.75 23.83,11.41 D8.2 23.83,10.49 23.5,10.16 23.5,8.57
  Top 0.305: 23.5,8.57 23.5,7.94 23.81,7.62 23.81,3.49 23.18,2.86 22.62,2.86 C30.2
  Top 0.5: C17.2 R7.1 22.64,1.69 | D1.1 21.42,3.35 21.83,2.93 C30.2
  Top 0.61: 22.64,1.69 22.64,2.83 C30.2
  Top 0.8: 22.54,2.86 C30.2
N$18
  Top 0.406: Q1.6 20.27,50.48 SW1.2
N$19
  Top 0.25: D8.3 24.29,12.55 24.76,13.02 24.76,20.96 23.97,21.75 C27.1 | R9.2 22.38,22.22 22.46,22.3
  Top 0.406: C27.1 22.46,22.3
N$20
  Top 0.25: R15.1 R18.1 13.12,19.63 12.07,18.57 IC9.2
N$21
  Top 0.254: 10.79,50.08 C2.1
  Top 0.305: C2.1 10.57,49.85 11.75,49.85 13.39,48.2 13.39,44.93 R2.2 | 14.61,52.07 14.61,52.08
  Top 0.4: Q1.3 Q1.2 | 14.61,49.5 U1.4
  Top 0.406: 14.21,51.67 14.61,52.07 Q1.3 | 14.21,51.67 C3.1 | 14.61,49.5 14.61,51.28 14.21,51.67
  Top 0.61: C3.1 13.26,51.75 11.75,51.75 11.43,51.44 L1.2 10.79,50.85 10.79,50.08
N$22
  Bottom 0.152: 22.43,40.39 22.43,40.08 22.12,40.08 | 22.12,40.08 22.12,40.39 | 22.12,40.08 22.12,39.78
N$23
  Bottom 0.152: 21.82,40.39 21.51,40.39 21.51,40.08 21.82,40.08 21.82,39.78 21.51,39.78
N$24  (via drill 0.4)
  Top 0.254: IC1.28 12.07,40.96 11.75,41.28 11.75,41.59 11.11,42.23 10.48,42.23 10.16,42.55 6.99,42.55 v6.03,43.5
  Bottom 0.406: v6.03,43.5 5.62,43.5 PE0.1
N$28
  Top 0.61: R4.2 14.71,47.12 U1.5
N$31  (via drill 0.4)
  Top 0.25: 20.32,46.12 C4.1
  Top 0.5: 20.32,46.12 v20.32,47.31 20.32,48.58 19.75,49.15 SW1.3 19.03,49.21 U1.3 | U1.3 17.46,49.21 | U1.3
  Bottom 0.5: BAT1.+2 13.02,40 15.56,42.55 15.56,45.4 17.46,47.31 v20.32,47.31 24.45,51.44 B+.TP
N$56
  Top 0.305: 9.21,8.57 9.53,8.89 9.53,9.42 R25.2 | 9.53,7.88 9.53,8.25 9.21,8.57 | Q4.1 3.18,16.69 3.18,13.33 3.18,13.02 3.18,12.06 6.67,8.57 9.21,8.57
  Top 0.406: R25.2 | Q4.1 R20.1 | 9.53,7.88 9.43,7.88 C23.2
N$59
  Top 0.406: C5.1 7.54,43.52 R5.2 | J1.SHLD2 3.69,50.49 3.36,50.81 2.09,50.81 J1.SHLD6 | J1.SHLD4 2.07,51.46 | 2.07,51.46 | 2.07,51.46 J1.SHLD6 | J1.SHLD6 | J1.SHLD6 J1.SHLD8 J1.SHLD7 J1.SHLD5 | J1.SHLD5 J1.SHLD3 | J1.SHLD1 3.68,45.39 3.36,45.08 J1.SHLD5
  Top 0.61: C5.1 5.24,44.93 J1.SHLD1
N$1234
  Top 0.25: IC6.1 15.44,14.4 15.66,14.18 R31.2 R11.1 15.66,10.66 C20.1
N$11111
  Top 0.25: R29.2 20.22,22.44 19.37,21.59 19.37,20.96 19.68,20.64 20.64,20.64 20.8,20.48 20.96,20.32 20.97,20.3 IC3.1
N$12345
  Top 0.305: 6.03,20.96 R21.2
  Top 0.406: R19.1 R21.2 5.82,20.96 5.4,20.96 5.14,20.69 R20.2 | R20.2 4.45,20.64 | R20.2 C22.1 | C22.1 | 6.03,20.96
PDI-CLK  (via drill 0.4)
  Top 0.25: 7.28,35.9 7.33,35.9 7.62,36.19 7.62,37.15 v6.67,38.1 | v4.45,28.57 5.08,29.21 5.08,31.43 v4.76,31.75
  Top 0.254: 7.4,41.28 R1.1
  Top 0.3: 7.28,35.9 IC1.35
  Top 0.406: v6.67,38.1 7.4,38.84 7.4,41.28
  Bottom 0.25: X1.5 3.81,27.94 v4.45,28.57 | v6.67,38.1 5.71,37.15 5.71,32.7 v4.76,31.75
PDI-DATA  (via drill 0.4)
  Top 0.25: 6.48,36.7 6.48,37.02 v5.4,38.1
  Top 0.3: 6.48,36.7 IC1.34
  Bottom 0.25: v5.4,38.1 5.18,37.88 5.18,34.07 4.13,33.02 X1.1
RBUTTON
  Top 0.25: 8.86,26.01 IC1.2 | 2.7,18.57 3.02,18.89
  Top 0.254: 8.86,26.01 8.25,25.4 8.08,25.23 3.48,25.23 3.17,24.91 3.17,19.04 3.02,18.89 | 2.7,18.57 2.7,14.13 1.59,13.02 1.42,12.85 1.42,9.38 3.49,7.3 3.49,5.4 2.86,4.76 RBTN.4
RSSI  (via drill 0.4)
  Top 0.25: 22.3,25.43 R10.2 | 22.33,24.08 R9.1 | IC1.41 9.51,31.1 | v22.21,30.94 22.3,30.85
  Top 0.406: 22.3,25.43 C32.1 22.3,30.85 | R10.2 22.33,24.08 | v15.24,34.29 12.7,34.29 9.51,31.1
  Bottom 0.406: v15.24,34.29 16.19,34.29 18.42,32.07 21.08,32.07 v22.21,30.94
SUBCARRIER-OOK/MOD
  Top 0.25: R29.1 R30.2 18.52,26.77 19.83,28.08 19.83,30.46 19.19,31.1 IC1.15 16.82,31.1 16.51,30.8 16.51,28.26 16.67,28.1 16.67,21.43 15.56,20.32 R18.2
SUBCARRIER-PSK
  Top 0.25: IC4.2 18.1,20.64 17.61,21.13 17.61,26.81 19.35,28.56 19.35,29.99 19.04,30.3 IC1.14
USB-DM
  Top 0.254: 5.08,48.58 12.07,48.58 12.7,47.94 12.7,44.45 13.02,44.13 13.02,41.91 13.65,41.28 13.65,38.73 13.67,38.72 IC1.26
  Top 0.305: IC1.26 13.67,38.58 | 5.08,48.58 4.74,48.58 J1.D-
USB-DP
  Top 0.254: 5.08,47.94 11.75,47.94 12.07,47.62 12.07,44.13 12.38,43.81 12.38,41.56 12.85,41.1 12.85,38.92 12.86,38.9
  Top 0.305: IC1.27 12.86,38.9 | 5.08,47.94 J1.D+
USB-SENSE
  Top 0.305: IC1.25 14.46,40.5 15.87,41.91 R3.2 | R3.2 | R3.2 R2.1
VCC
  Top 0.4: Q1.4 Q1.5 16.19,50.95 16.84,51.6 Q1.1 16.87,52.11 18.47,52.11 19.07,52.7 21.26,52.7 21.54,52.43 21.54,50.9 22.1,50.33 23.8,50.33 24.04,50.09 24.04,49.2 SW1.1 | 24.09,49.25 SW1.1 | C8.1 23.42,47.87 24.09,48.54 SW1.1
  Top 0.5: IC2.3 23.96,46.21 23.42,46.75 C8.1

### Text on the board
tPlace: OFF | www.kasper-oswald.com
bPlace: ChameleonMini | Use 3.6V Li-Ion rechargeable | battery only! (LIR-2032) | Based on the / open-source NFC tool ChameleonMini: / https://github.com/emsec/ChameleonMini | MADE IN GERMANY
tNames: VCC | TXD | GND
bNames: OFF | DATA | RXD | CLK | Rev.G